# Altium project PCB RADAR.PrjPcb
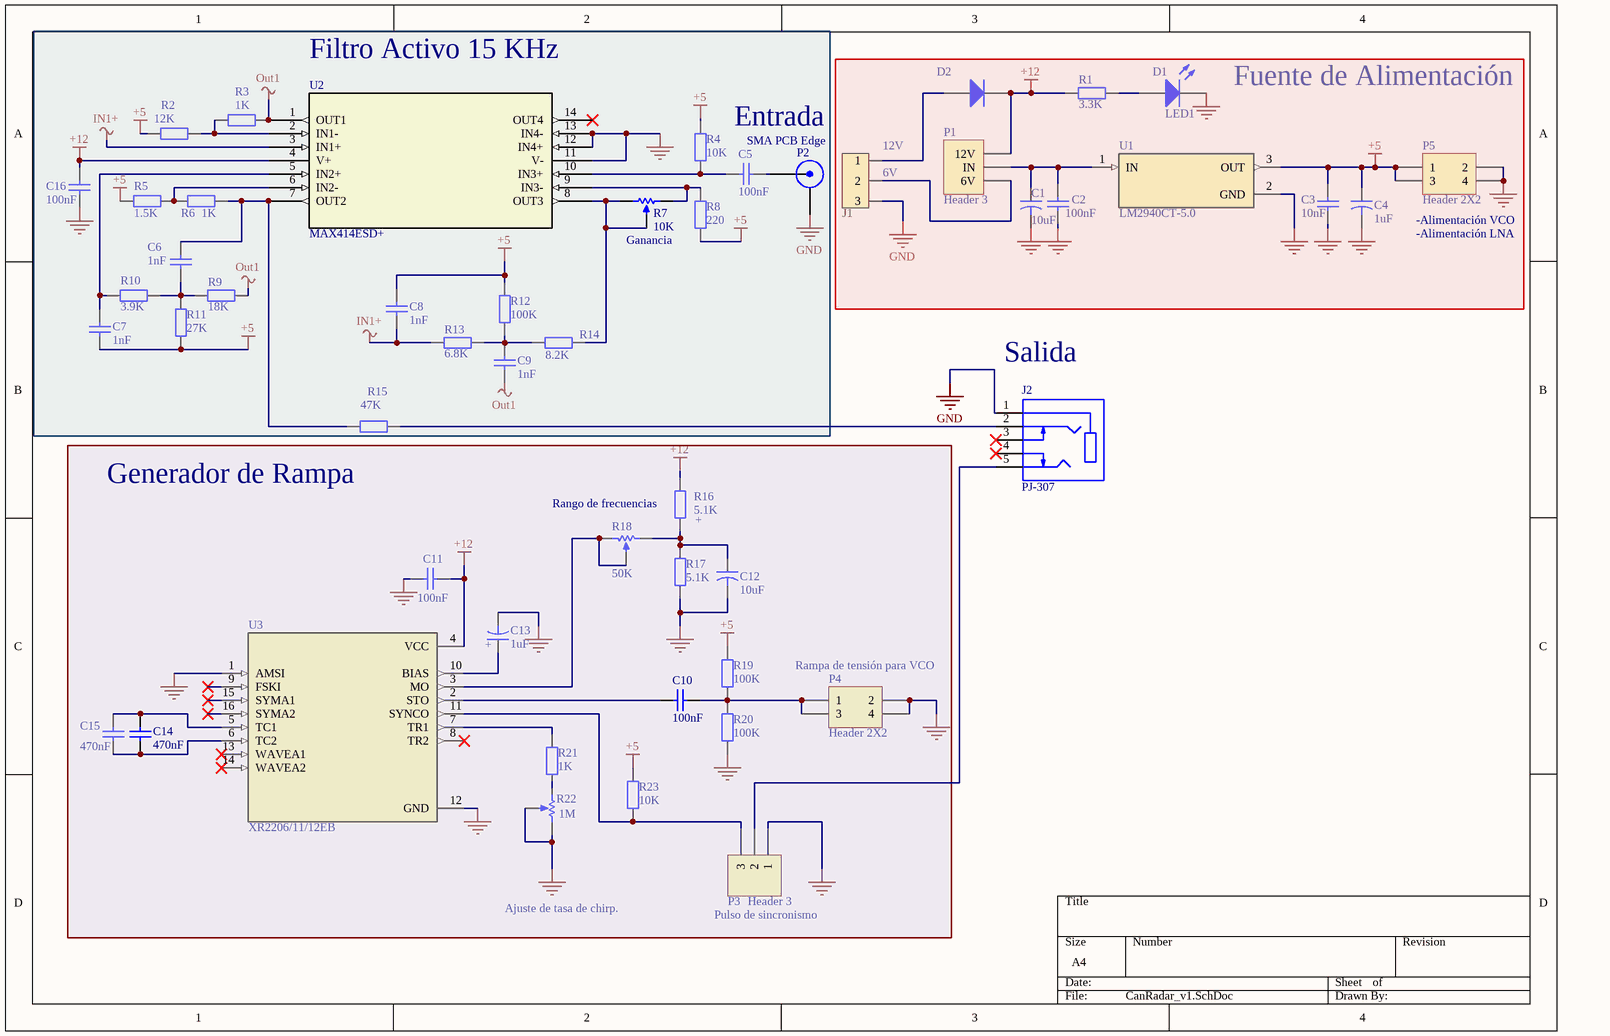
[diagram p0: CanRadar_v1.SchDoc]
1 sheet, 51 parts. Net scope: global (net labels, ports and power ports of the same name join across sheets).
Board file: CanRadar_v1.PcbDoc

## Sheet CanRadar_v1.SchDoc
size A4

### Parts
C1  value 10uF  [CAPPR3.5-8x11.5]  (hidden comment: Cap2)
C2  value 100nF  [RAD-0.2]  (hidden comment: Cap)
C3  value 10nF  [RAD-0.2]  (hidden comment: Cap)
C4  value 1uF  [CAPPR3.5-8x11.5]  (hidden comment: Cap2)
C5  value 100nF  [RAD-0.2]  (hidden comment: Cap)
C6  value 1nF  [RAD-0.2]  (hidden comment: Cap)
C7  value 1nF  [RAD-0.2]  (hidden comment: Cap)
C8  value 1nF  [RAD-0.2]  (hidden comment: Cap)
C9  value 1nF  [RAD-0.2]  (hidden comment: Cap)
C10  value 100nF  [RAD-0.2]  (hidden comment: Cap)
C11  value 100nF  [RAD-0.2]  (hidden comment: Cap)
C12  value 10uF  [CAPPR3.5-8x11.5]  (hidden comment: Cap2)
C13  value 1uF  [CAPPR3.5-8x11.5]  (hidden comment: Cap2)
C14  value 470nF  [RAD-0.2]  (hidden comment: Cap)
C15  value 470nF  [RAD-0.2]  (hidden comment: Cap)
C16  value 100nF  [RAD-0.2]  (hidden comment: Cap)
D1  LED1  [LED]
D2  Diode 1N4001  [DO-41]  (value not drawn)
J1  Borne x 3  [BORNE-3x0.2]  (value not drawn)
J2  PJ-307  [3.5mm Jack]
P1  Header 3  [HDR1X3]
P2  SMA PCB Edge  [SMA PCB 1.6mm]
P3  Header 3  [HDR1X3]
P4  Header 2X2  [HDR2X2]
P5  Header 2X2  [HDR2X2]
R1  value 3.3K  [AXIAL-0.4]  (hidden comment: Res2)
R2  value 12K  [AXIAL-0.4]  (hidden comment: Res2)
R3  value 1K  [AXIAL-0.4]  (hidden comment: Res2)
R4  value 10K  [AXIAL-0.4]  (hidden comment: Res2)
R5  value 1.5K  [AXIAL-0.4]  (hidden comment: Res2)
R6  value 1K  [AXIAL-0.4]  (hidden comment: Res2)
R7  value 10K  [TRIMMER-V]  (hidden comment: RPot)
R8  value 220  [AXIAL-0.4]  (hidden comment: Res2)
R9  value 18K  [AXIAL-0.4]  (hidden comment: Res2)
R10  value 3.9K  [AXIAL-0.4]  (hidden comment: Res2)
R11  value 27K  [AXIAL-0.4]  (hidden comment: Res2)
R12  value 100K  [AXIAL-0.4]  (hidden comment: Res2)
R13  value 6.8K  [AXIAL-0.4]  (hidden comment: Res2)
R14  value 8.2K  [AXIAL-0.4]  (hidden comment: Res2)
R15  value 47K  [AXIAL-0.4]  (hidden comment: Res2)
R16  value 5.1K  [AXIAL-0.4]  (hidden comment: Res2)
R17  value 5.1K  [AXIAL-0.4]  (hidden comment: Res2)
R18  value 50K  [POTE]  (hidden comment: RPot)
R19  value 100K  [AXIAL-0.4]  (hidden comment: Res2)
R20  value 100K  [AXIAL-0.4]  (hidden comment: Res2)
R21  value 1K  [AXIAL-0.4]  (hidden comment: Res2)
R22  value 1M  [POTE]  (hidden comment: RPot)
R23  value 10K  [AXIAL-0.4]  (hidden comment: Res2)
U1  LM2940CT-5.0  [TO254P1054X470X1955-3]
U2  MAX414ESD+  [21-0041B_14_MXM-M]
U3  XR2206/11/12EB  [DIP-16]

### Blocks framed on the sheet
Fuente de Alimentación: C1-C4 D1 D2 J1 P1 P5 R1 U1
Generador de Rampa: C10-C15 P3 P4 R16-R23 U3

### Nets
+5: C3.1 C4.2(-) C7.2 C8.1 P5.1 P5.3 R2.1 R4.2 R5.1 R8.1 R11.1 R12.2 R19.2 R23.1 U1.3(OUT)
+12: C11.2 C16.1 D2.2(K) P1.1(12V) R1.2 R16.1 U2.4(V+) U3.4(VCC)
GND: C1.1(+) C2.2 C3.2 C4.1(+) C11.1 C12.1(+) C13.1(+) C16.2 D1.2(K) J1.3 J2.1 P2.2(Y) P3.1 P4.2 P4.4 P5.2 P5.4 R17.2 R20.1 R22.2(BOT) R22.3(TAP) U1.2(GND) U2.11(V-) U2.12(IN4+) U2.13(IN4-) U3.1(AMSI) U3.12(GND)
IN1+: C8.2 R13.2 U2.3(IN1+)
Out1: C9.2 R3.2 R9.1 U2.1(OUT1)
NetC1_2: C1.2(-) C2.1 P1.2(IN) U1.1(IN)
NetC5_1: C5.1 R4.1 U2.10(IN3+)
NetC5_2: C5.2 P2.1(X)
NetC6_1: C6.1 R6.2 R15.1 U2.7(OUT2)
NetC6_2: C6.2 R9.2 R10.1 R11.2
NetC7_1: C7.1 R10.2 U2.5(IN2+)
NetC9_1: C9.1 R12.1 R13.1 R14.1
NetC10_1: C10.1 U3.2(STO)
NetC10_2: C10.2 P4.1 P4.3 R19.1 R20.2
NetC12_2: C12.2(-) R16.2 R17.1 R18.1(TOP)
NetC13_2: C13.2(-) U3.10(BIAS)
NetC14_1: C14.1 C15.2 U3.6(TC2)
NetC14_2: C14.2 C15.1 U3.5(TC1)
NetD1_1: D1.1(A) R1.1
NetD2_1: D2.1(A) J1.1
NetJ1_2: J1.2 P1.3(6V)
NetJ2_2: J2.2 R15.2
NetJ2_5: J2.5 P3.2
NetP3_3: P3.3 R23.2 U3.11(SYNCO)
NetR2_2: R2.2 R3.1 U2.2(IN1-)
NetR5_2: R5.2 R6.1 U2.6(IN2-)
NetR7_1: R7.1(TOP) R7.3(TAP) R14.2 U2.8(OUT3)
NetR7_2: R7.2(BOT) R8.2 U2.9(IN3-)
NetR18_2: R18.2(BOT) R18.3(TAP) U3.3(MO)
NetR21_1: R21.1 R22.1(TOP)
NetR21_2: R21.2 U3.7(TR1)

Not connected (* = marked no-connect by the designer): J2 3* 4*; U2 14(OUT4)*; U3 8(TR2)* 9(FSKI)* 13(WAVEA1)* 14(WAVEA2)* 15(SYMA1)* 16(SYMA2)*

### Notes on the sheet
- Filtro Activo 15 KHz
- Entrada
- (near J1) 12V
- (near J1) 6V
- Ganancia
- -Alimentación VCO
- -Alimentación LNA
- (near J2) Salida
- (near R16) Rango de frecuencias
- (near R16) +
- (near C13) +
- (near P4) Rampa de tensión para VCO
- Ajuste de tasa de chirp.
- Pulso de sincronismo

### Library data of the parts
C1 C4 C12 C13 = Cap2: Capacitor; pin to pad: 1>2 2>1; Published: 23-Sep-2002; PackageReference: CAPPR3.5-8x11.5; Publisher: Altium Limited; PackageDescription: Capacitor; 2 Leads
C2 C3 C5-C11 C14-C16 = Cap: Capacitor; Published: 8-Jun-2000; LatestRevisionDate: 17-Jul-2002; LatestRevisionNote: Re-released for DXP Platform.; PackageReference: RAD-0.2; Publisher: Altium Limited; PackageDescription: Radial Cap, Thru-Hole; 2 Leads; 0.3 in Pin Spacing
D1 = LED1: Typical RED GaAs LED; Published: 8-Jun-2000; LatestRevisionDate: 08-Jul-2005; LatestRevisionNote: Mech Layer 1 removed.; PackageReference: LED-1; Publisher: Altium Limited; PackageDescription: LED; 2 Leads
D2 = Diode 1N4001: 1 Amp General Purpose Rectifier; Published: 8-Jun-2000; LatestRevisionDate: 17-Jul-2002; LatestRevisionNote: Re-released for DXP Platform.; DatasheetVersion: 1998; PackageVersion: Aug-1999; PackageReference: DO-41; Publisher: Altium Limited; PackageDescription: Diode, Axial; Body 5.2 x 2.7 mm (LxDia. max), Lead Dia. 0.86 mm (max); Code_JEDEC: DO-204-AL; ComponentLink1Description: Manufacturer Link; ComponentLink1URL: http://www.fairchildsemi.com/; ComponentLink2Description: Datasheet; ComponentLink2URL: http://www.fairchildsemi.com/ds/1N%2F1N4001.pdf
J1 = Borne x 3: Triple borne para circuito impreso
J2 = PJ-307: 3.5 mm, Stereo, Right Angle, Through Hole, Audio Jack Connector; MP: SJ1-3535N; MF: CUI Devices; CUI_purchase_URL: https://www.cuidevices.com/product/interconnect/connectors/audio-connectors/jacks/sj1-353xn-series?utm_source=snapeda.com&utm_medium=referral&utm_campaign=snapedaBOM; Value: *; SnapEDA_Link: https://www.snapeda.com/parts/SJ1-3535N/CUI%20Devices/view-part/533084/?ref=snap; Availability: Unavailable; Package: None; Price: None
P1 P3 = Header 3: Header, 3-Pin; LatestRevisionDate: 17-Jul-2002; LatestRevisionNote: Re-released for DXP Platform.; Publisher: Altium Limited
P2 = SMA PCB Edge: SMA conector- edge mounting -for PCB.
P4 P5 = Header 2X2: Header, 2-Pin, Dual row; LatestRevisionDate: 17-Jul-2002; LatestRevisionNote: Re-released for DXP Platform.; Publisher: Altium Limited
R1-R6 R8-R17 R19-R21 R23 = Res2: Resistor; Published: 8-Jun-2000; LatestRevisionDate: 17-Jul-2002; LatestRevisionNote: Re-released for DXP Platform.; PackageReference: AXIAL-0.4; Publisher: Altium Limited; PackageDescription: Axial Device, Thru-Hole; 2 Leads; 0.4 in Pin Spacing
R7 R18 R22 = RPot: Potentiometer; pin to pad: 2>3 3>2; Sim Note: Enter the Resistance value and the set point into parameter fields.; Set Position: 0.5; Published: 8-Jun-2000; LatestRevisionDate: 17-Jul-2002; LatestRevisionNote: Re-released for DXP Platform.; PackageReference: VR5; Publisher: Altium Limited; PackageDescription: Variable Resistor, Thru-Hole; 3 Leads
U1 = LM2940CT-5.0: 1-A, 26-V, high-PSRR, low-dropout voltage regulator 3-TO-220 0 to 125; MF: Texas Instruments; MP: LM2940CT-5.0; Value: *; SnapEDA_Link: https://www.snapeda.com/parts/LM2940CT-5.0/Texas%20Instruments/view-part/213981/?ref=snap; Mouser-Purchase-URL: https://snapeda.com/shop?store=Mouser&id=213981; Price: None; DigiKey-Purchase-URL: https://snapeda.com/shop?store=DigiKey&id=213981; Package: TO-220-3 Texas Instruments; Availability: Warning; BuyPart: https://www.snapeda.com/parts/LM2940CT-5.0/Texas%20Instruments/view-part/213981/?ref=eda
U2 = MAX414ESD+: No Description Available; Mfr_Name: Maxim Integrated Products; Copyright: Copyright (C) 2022 Ultra Librarian. All rights reserved.; Manufacturer_Part_Number: MAX414ESD+; RefDes: RefDes; Type: DEV
U3 = XR2206/11/12EB: XR2206, XR2211, XR2212 Multi-Purpose Timing Evaluation Board; MF: MaxLinear, Inc.; SnapEDA_Link: https://www.snapeda.com/parts/XR2206/11/12EB/MaxLinear%2C%20Inc./view-part/230277/?ref=snap; Package: TSSOP-20 Exar; Digi-Key_Purchase_URL: https://www.digikey.com/product-detail/en/maxlinear-inc/XR2206-11-12EB/1016-1428-ND/2636661?utm_source=snapeda&utm_medium=aggregator&utm_campaign=symbol; Value: *; MP: XR2206/11/12EB; Digi-Key_Part_Number: 1016-1428-ND